# EasyEDA Pro project MicroMouse_v01.eprj, board PCB1
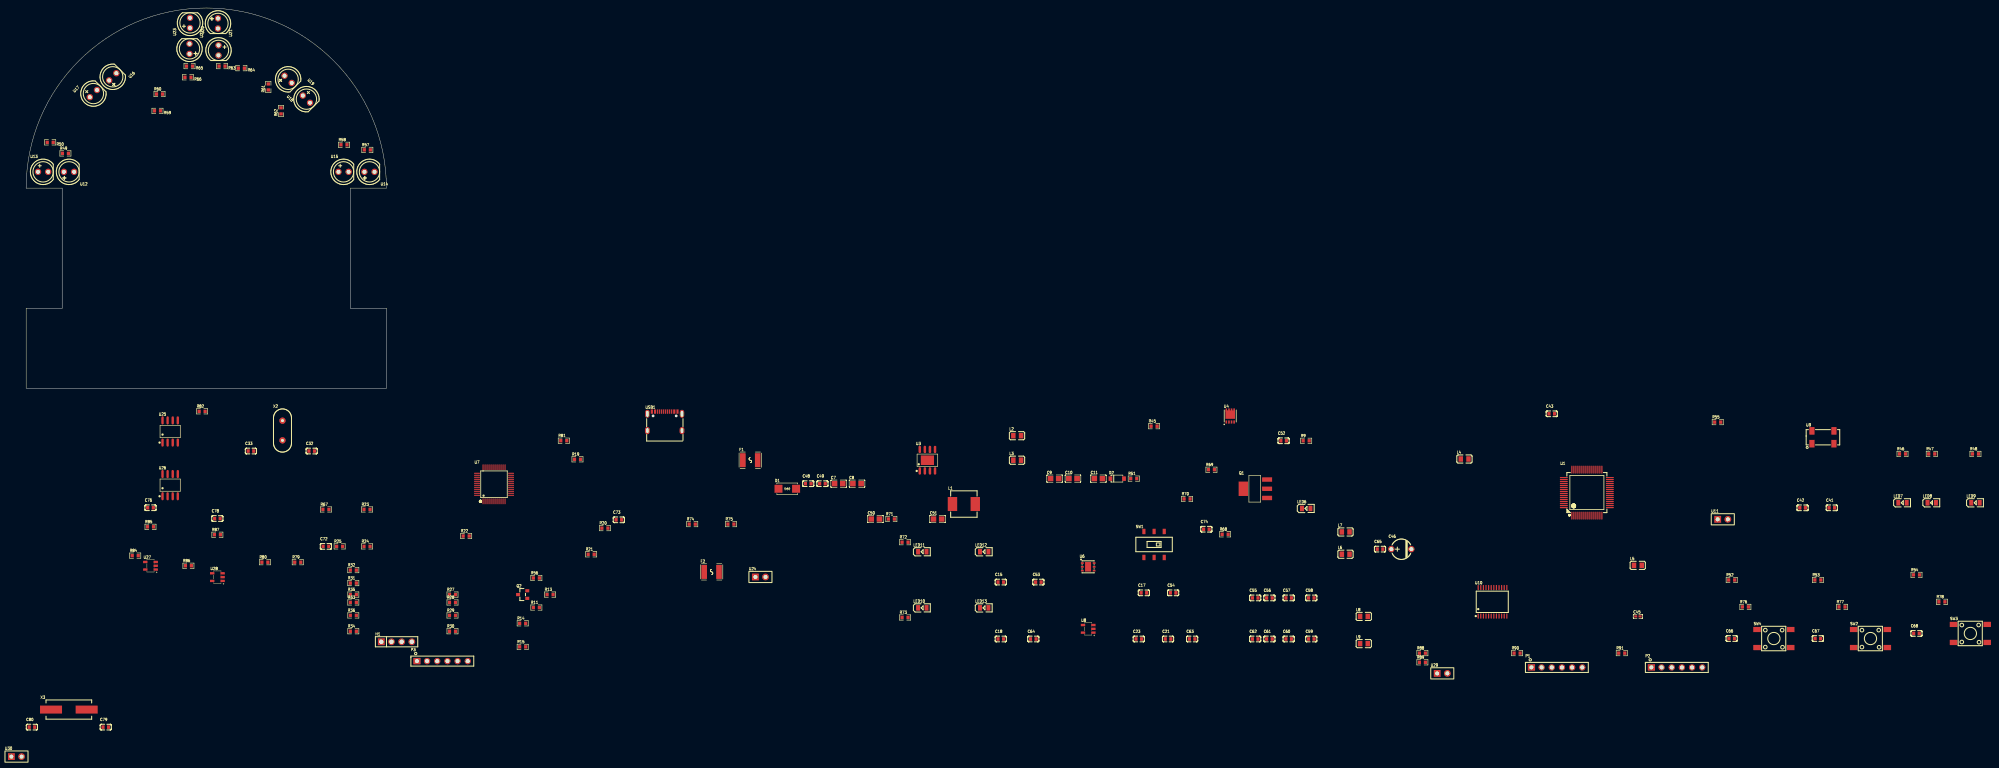
[diagram p5: board, top side]
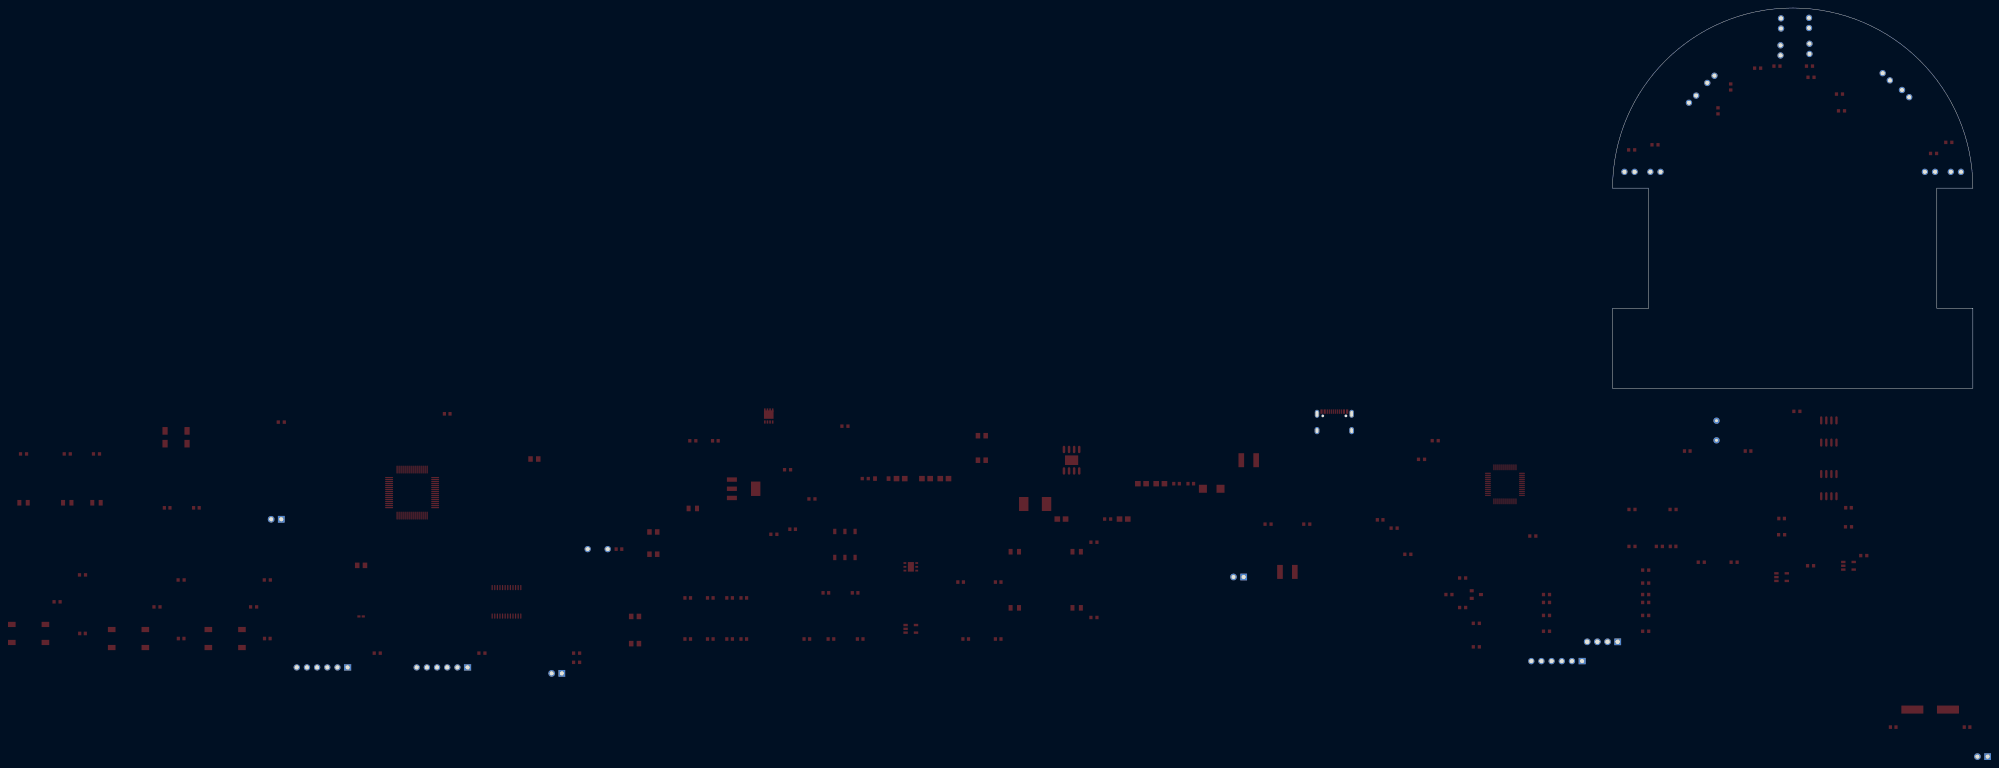
[diagram p6: board, bottom side, seen from below]

Outline 162.75 x 102.25 mm; copper layers: Top Layer, Bottom Layer. Coordinates in mm from the lower left corner of the outline.
Outline path: 0,57.25 9,57.25 9,27.25 0,27.25 0,7.25 90,7.25 90,27.25 81,27.25 81,57.25 90,57.25 arc(45,102.25) 0,57.25
Stack: Top Layer 0.035mm / Dielectric1 1.51mm FR4 er 4.5 / Bottom Layer 0.035mm

## Design rules (mm)
template: JLCPCB Capability(Two Layers Board)
spacing copperThickness1oz (default): track to track 0.102, other pairs 0.152 to 0.3
spacing copperThickness2oz: track to track 0.203, other pairs 0.152 to 0.3
track width copperThickness1oz (default): min 0.127, default 0.254, max 2.54
track width copperThickness2oz: min 0.203, default 0.254, max 2.54
differential pair differentialPair (default): width min 0.127, default 0.254, max 2.54; gap min 0.152, default 0.152
via viaSize (default): diameter min 0.5, default 0.61, max 10; hole min 0.3, default 0.305, max 6.3

## Placement (name value [footprint] x y rotation side)
C7  10uF  [C0805]  202.98 -16.6 0 top
C8  10uF  [C0805]  207.56 -16.6 0 top
C9  10uF  [C0805]  256.92 -15.33 0 top
C10  10uF  [C0805]  261.5 -15.33 0 top
C11  10uF  [C0805]  267.85 -15.33 0 top
C15  1uF  [C0603]  243.48 -41.18 0 top
C17  1uF  [C0603]  279.23 -43.87 0 top
C18  1uF  [C0603]  243.48 -55.4 0 top
C21  1uF  [C0603]  285.26 -55.4 0 top
C23  10nF  [C0603]  277.96 -55.4 0 top
C32  20pF  [C0603]  71.34 -8.44 0 top
C33  20pF  [C0603]  56.16 -8.44 0 top
C41  4.3pF  [C0603]  451.08 -22.63 0 top
C42  4.3pF  [C0603]  443.78 -22.63 0 top
C43  1uF  [C0603]  381.12 0.86 0 top
C45  100nF  [C0402]  402.63 -49.76 0 top
C46  10uF  [CAP-TH_BD5.0-P5.00-D1.0-FD]  343.53 -32.95 0 top
C48  100nF  [C0603]  195.37 -16.6 0 top
C49  100nF  [C0603]  198.92 -16.6 0 top
C50  10uF  [C0805]  212.14 -25.43 0 top
C51  10uF  [C0805]  227.68 -25.43 0 top
C52  100nF  [C0603]  314.13 -5.88 0 top
C53  100nF  [C0603]  252.86 -41.18 0 top
C54  100nF  [C0603]  286.53 -43.87 0 top
C55  100nF  [C0603]  307.03 -45.14 0 top
C56  100nF  [C0603]  310.58 -45.14 0 top
C57  100nF  [C0603]  315.4 -45.14 0 top
C58  100nF  [C0603]  321.04 -45.14 0 top
C59  100nF  [C0603]  321.04 -55.4 0 top
C60  100nF  [C0603]  315.4 -55.4 0 top
C61  100nF  [C0603]  310.58 -55.4 0 top
C62  100nF  [C0603]  307.03 -55.4 0 top
C63  100nF  [C0603]  291.28 -55.4 0 top
C64  100nF  [C0603]  251.59 -55.4 0 top
C65  100nF  [C0603]  338.22 -32.95 0 top
C66  100nF  [C0603]  426.06 -55.29 0 top
C67  100nF  [C0603]  447.59 -55.29 0 top
C68  100nF  [C0603]  472.23 -54.02 0 top
C72  100nF  [C0603]  74.89 -32.27 0 top
C73  20pF  [C0603]  148.07 -25.63 0 top
C74  10nF  [C0603]  294.83 -27.97 0 top
C76  100pF  [C0603]  31.06 -22.61 0 top
C78  100pF  [C0603]  47.77 -25.3 0 top
C79  20pF  [C0603]  19.9 -77.42 0 top
C80  20pF  [C0603]  1.45 -77.42 0 top
D1  SMAJ20CA  [SMA_L4.3-W2.6-LS5.2-BI]  190.14 -17.87 0 top
D2  MMSZ4689  [SOD-123_L2.8-W1.8-LS3.7-RD]  272.56 -15.33 0 top
F1  ASMD1812-300  [F1812]  180.89 -10.73 0 top
F2  ASMD1812-300  [F1812]  171.23 -38.64 0 top
H1  2.54-1*4P  [HDR-TH_4P-P2.54-V-F]  92.53 -56.09 0 top
L1  1uH  [IND-SMD_L7.2-W6.6_GPSR0730]  234.25 -21.68 0 top
L2  CBW201209U601T  [L0805]  247.57 -4.61 0 top
L3  CBW201209U601T  [L0805]  247.57 -10.73 0 top
L4  CBW201209U601T  [L0805]  359.34 -10.43 0 top
L5  CBW201209U601T  [L0805]  402.63 -37 0 top
L6  CBW201209U601T  [L0805]  329.63 -34.22 0 top
L7  CBW201209U601T  [L0805]  329.63 -28.65 0 top
L8  CBW201209U601T  [L0805]  334.19 -49.76 0 top
L9  CBW201209U601T  [L0805]  334.19 -56.56 0 top
LED6  XL-2012SURC  [LED0805-R-RD]  319.77 -22.78 0 top
LED7  XL-2012SURC  [LED0805-R-RD]  468.73 -21.36 0 top
LED8  XL-2012SURC  [LED0805-R-RD]  476.04 -21.36 0 top
LED9  XL-2012SURC  [LED0805-R-RD]  486.96 -21.36 0 top
LED10  XL-2012SURC  [LED0805-R-RD]  223.87 -47.62 0 top
LED11  XL-2012SURC  [LED0805-R-RD]  223.87 -33.6 0 top
LED12  XL-2012SURC  [LED0805-R-RD]  239.33 -33.6 0 top
LED13  XL-2012SURC  [LED0805-R-RD]  239.33 -47.62 0 top
P1  2.54-1*6P  [HDR-TH_6P-P2.54-V-F]  382.39 -62.5 0 top
P2  2.54-1*6P  [HDR-TH_6P-P2.54-V-F]  412.35 -62.5 0 top
P3  2.54-1*6P  [HDR-TH_6P-P2.54-V-F]  103.96 -60.93 0 top
Q1  IRLL014NTRPBF  [SOT-223-3_L6.5-W3.4-P2.30-LS7.0-BR]  307.03 -17.87 0 top
Q2  S9013  [SOT-23_L2.9-W1.3-P1.90-LS2.4-BR]  124.04 -44.3 0 top
R9  10K  [R0603]  319.77 -5.88 0 top
R11  36kΩ  [R0603]  127.46 -47.54 0 top
R13  100Ω  [R0603]  130.88 -44.3 0 top
R14  1.5kΩ  [R0603]  124.04 -51.49 0 top
R15  0Ω  [R0603]  124.04 -57.36 0 top
R19  0Ω  [R0603]  137.73 -10.51 0 top
R20  100Ω  [R0603]  144.57 -27.7 0 top
R21  100Ω  [R0603]  141.15 -34.24 0 top
R22  0Ω  [R0603]  109.93 -29.68 0 top
R23  4.7kΩ  [R0603]  85.16 -23.04 0 top
R24  4.7kΩ  [R0603]  85.16 -32.27 0 top
R25  0Ω  [R0603]  78.31 -32.27 0 top
R27  0Ω  [R0603]  106.5 -44.3 0 top
R28  0Ω  [R0603]  106.5 -46.27 0 top
R29  0Ω  [R0603]  106.5 -49.51 0 top
R30  0Ω  [R0603]  106.5 -53.46 0 top
R31  0Ω  [R0603]  81.73 -41.43 0 top
R32  0Ω  [R0603]  81.73 -38.19 0 top
R33  0Ω  [R0603]  81.73 -46.27 0 top
R34  0Ω  [R0603]  81.73 -53.46 0 top
R35  0Ω  [R0603]  81.73 -44.3 0 top
R36  0Ω  [R0603]  81.73 -49.51 0 top
R45  10K  [R0603]  281.77 -2.23 0 top
R46  10K  [R0603]  468.73 -9.16 0 top
R47  10K  [R0603]  476.04 -9.16 0 top
R48  10K  [R0603]  486.96 -9.16 0 top
R49  150Ω  [R0603]  9.81 65.92 0 top
R50  10K  [R0603]  6.01 68.68 180 top
R51  10K  [R0603]  276.69 -15.33 0 top
R52  10K  [R0603]  426.06 -40.65 0 top
R53  10K  [R0603]  447.59 -40.65 0 top
R54  10K  [R0603]  472.23 -39.38 0 top
R55  10K  [R0603]  422.57 -1.21 0 top
R56  10K  [R0603]  127.46 -40.16 0 top
R57  150Ω  [R0603]  85.23 66.8 0 top
R58  10K  [R0603]  79.4 68.07 0 top
R59  150Ω  [R0603]  32.81 76.56 180 top
R60  10K  [R0603]  33.32 80.75 0 top
R61  150Ω  [R0603]  60.49 82.53 90 top
R62  10K  [R0603]  63.67 76.56 90 top
R63  150Ω  [R0603]  48.94 87.73 180 top
R64  10K  [R0603]  53.76 87.22 180 top
R65  150Ω  [R0603]  40.81 87.73 180 top
R66  10K  [R0603]  40.43 84.94 180 top
R67  100kΩ  [R0603]  74.89 -23.04 0 top
R68  100kΩ  [R0603]  299.52 -29.24 0 top
R69  100kΩ  [R0603]  296.1 -13.11 0 top
R70  1kΩ  [R0603]  290.01 -20.41 0 top
R71  56kΩ  [R0603]  216.14 -25.43 0 top
R72  1kΩ  [R0603]  219.56 -31.22 0 top
R73  1kΩ  [R0603]  219.56 -50.03 0 top
R74  5.1kΩ  [R0603]  166.4 -26.7 0 top
R75  5.1kΩ  [R0603]  176.06 -26.7 0 top
R76  1kΩ  [R0603]  429.48 -47.38 0 top
R77  1kΩ  [R0603]  453.62 -47.38 0 top
R78  1kΩ  [R0603]  478.58 -46.11 0 top
R79  10K  [R0603]  67.84 -36.21 0 top
R80  10K  [R0603]  59.64 -36.21 0 top
R81  100kΩ  [R0603]  134.3 -5.85 0 top
R82  4.7kΩ  [R0603]  43.96 1.48 0 top
R84  10K  [R0603]  27.25 -34.56 0 top
R85  22kΩ  [R0603]  31.06 -27.37 0 top
R86  10K  [R0603]  40.54 -37.1 0 top
R87  22kΩ  [R0603]  47.77 -29.35 0 top
R88  0Ω  [R0603]  348.79 -58.94 0 top
R89  0Ω  [R0603]  348.79 -61.23 0 top
R90  0Ω  [R0603]  372.45 -58.94 0 top
R91  0Ω  [R0603]  398.6 -58.94 0 top
SW1  SS-3235S-L3  [SW-SMD_SS-3235S-L3.00]  281.77 -31.78 0 top
SW2  TS-1002S-04326C  [KEY-SMD_4P-L6.0-W6.0-P4.50-LS9.0]  460.73 -55.29 0 top
SW3  TS-1002S-04326C  [KEY-SMD_4P-L6.0-W6.0-P4.50-LS9.0]  485.69 -54.02 0 top
SW4  TS-1002S-04326C  [KEY-SMD_4P-L6.0-W6.0-P4.50-LS9.0]  436.59 -55.29 0 top
U1  STM32F446RET6  [LQFP-64_L10.0-W10.0-P0.50-LS12.0-BL]  389.89 -18.82 0 top
U3  ETA9740E8A  [ESOP-8_L4.9-W3.9-P1.27-LS6.0-BL-EP-1]  225.14 -10.73 0 top
U4  AON7403  [DFN-8_L3.0-W3.0-P0.65-BL]  300.79 0.31 0 top
U6  LD39050PU33R  [DFN-6_L3.0-W3.0-P0.95-LS3.1-TL-EP]  265.31 -37.37 0 top
U7  STM32F103CBT6  [LQFP-48_L7.0-W7.0-P0.50-LS9.0-BL]  116.89 -16.75 0 top
U8  LD3985M33R  [SOT-23-5_L3.0-W1.7-P0.95-LS2.8-BR]  265.31 -52.86 0 top
U9  32.768kHz  [SOJ-4_L8.4-W3.8-P5.5-BL]  448.86 -5 0 top
U10  TB6612FNG,C,8,EL  [SSOP-24_L8.3-W5.6-P0.65-LS7.6-BL]  366.31 -46.11 0 top
U11  ZX-PM2.54-1-2PY  [HDR-TH_2P-P2.54-V-F]  423.84 -25.49 0 top
U12  HIR7373C  [LED-TH_BD5.0-P2.54-L-RD]  10.71 61.32 180 top
U13  DY-PD333-3B-L3  [LED-TH_BD5.0-P2.54-FD]  4.23 61.32 0 top
U14  HIR7373C  [LED-TH_BD5.0-P2.54-L-RD]  85.77 61.32 180 top
U15  DY-PD333-3B-L3  [LED-TH_BD5.0-P2.54-FD]  79.29 61.32 0 top
U16  HIR7373C  [LED-TH_BD5.0-P2.54-L-RD]  21.63 85.07 225 top
U17  DY-PD333-3B-L3  [LED-TH_BD5.0-P2.54-FD]  16.81 80.87 45 top
U18  HIR7373C  [LED-TH_BD5.0-P2.54-L-RD]  65.45 84.43 135 top
U19  DY-PD333-3B-L3  [LED-TH_BD5.0-P2.54-FD]  70.02 79.48 315 top
U20  HIR7373C  [LED-TH_BD5.0-P2.54-L-RD]  47.92 98.4 90 top
U21  DY-PD333-3B-L3  [LED-TH_BD5.0-P2.54-FD]  48.05 91.67 270 top
U22  HIR7373C  [LED-TH_BD5.0-P2.54-L-RD]  40.81 92.05 270 top
U23  DY-PD333-3B-L3  [LED-TH_BD5.0-P2.54-FD]  40.94 98.53 90 top
U24  ZX-PM2.54-1-2PY  [HDR-TH_2P-P2.54-V-F]  183.43 -39.91 0 top
U25  ACS722LLCTR-05AB-T  [SOIC-8_L4.9-W3.9-P1.27-LS6.0-BL]  35.98 -3.55 0 top
U26  ACS722LLCTR-05AB-T  [SOIC-8_L4.9-W3.9-P1.27-LS6.0-BL]  35.98 -16.96 0 top
U27  OPA344NA/250  [SOT-23-5_L3.0-W1.7-P0.95-LS2.8-BR]  31.06 -37.1 0 top
U28  OPA344NA/250  [SOT-23-5_L3.0-W1.7-P0.95-LS2.8-BR]  47.77 -39.94 0 top
U29  ZX-PM2.54-1-2PY  [HDR-TH_2P-P2.54-V-F]  353.76 -63.99 0 top
U30  ZX-PM2.54-1-2PY  [HDR-TH_2P-P2.54-V-F]  -2.41 -84.78 0 top
USB1  TYPE-C 16PIN 2MD(073)  [USB-C-SMD_TYPE-C-6PIN-2MD-073]  159.51 -0.96 0 top
X2  8MHz  [OSC-TH_L10.0-W4.5-P5.00]  64.03 -3.31 0 top
X3  8MHz  [CRYSTAL-SMD_L11.5-W4.8-LS12.7]  10.66 -73.04 0 top

## Footprints (pads in the part's own frame, mm; a bottom-side part is the same pattern mirrored in y, then rotated)
C0402
  rect 0.79x0.54 smd: 1(-0.545,0) 2(0.545,0)
C0603
  rect 0.8x0.9 smd: 1(-0.7,0) 2(0.7,0)
C0805
  rect 1.41x1.35 smd: 1(-1.03,0) 2(1.03,0)
CAP-TH_BD5.0-P5.00-D1.0-FD
  round 1.6 hole 1: 1(-2.5,0) 2(2.5,0)
CRYSTAL-SMD_L11.5-W4.8-LS12.7
  rect 5.5x2 smd: 1(-4.45,0) 2(4.45,0)
DFN-6_L3.0-W3.0-P0.95-LS3.1-TL-EP
  rect 0.701x0.45 smd: 1(-1.476,0.95) 2(-1.476,0) 3(-1.476,-0.95) 4(1.476,-0.95) 5(1.476,0) 6(1.476,0.95)
  rect 1.5x2.4 smd: 7(-0.025,0)
DFN-8_L3.0-W3.0-P0.65-BL
  rect 0.4x0.8 smd: 1(-0.975,-1.5) 2(-0.325,-1.5) 3(0.325,-1.5) 4(0.975,-1.5) 5(0.975,1.5) 6(0.325,1.5) 7(-0.325,1.5) 8(-0.975,1.5)
  rect 2.4x2.1 smd: 9(0,0.35)
ESOP-8_L4.9-W3.9-P1.27-LS6.0-BL-EP-1
  oval 0.63x1.865 smd: 1(-1.905,-2.683) 2(-0.635,-2.683) 3(0.635,-2.683) 4(1.905,-2.683) 5(1.905,2.683) 6(0.635,2.683) 7(-0.635,2.683) 8(-1.905,2.683)
  rect 3.3x2.4 smd: 9(0,0)
F1812
  rect 1.407x3.499 smd: 1(-1.853,0) 2(1.853,0)
HDR-TH_2P-P2.54-V-F
  rect 1.7x1.7 hole 1: 1(-1.27,0)
  round 1.7 hole 1: 2(1.27,0)
HDR-TH_4P-P2.54-V-F
  rect 1.7x1.7 hole 1.1: 1(-3.81,0)
  round 1.7 hole 1.1: 2(-1.27,0) 3(1.27,0) 4(3.81,0)
HDR-TH_6P-P2.54-V-F
  rect 1.8x1.6 hole 1.02: 1(-6.35,0)
  round 1.6 hole 1.02: 2(-3.81,0) 3(-1.27,0) 4(1.27,0) 5(3.81,0) 6(6.35,0)
IND-SMD_L7.2-W6.6_GPSR0730
  rect 2.35x3.5 smd: 1(-2.85,0) 2(2.85,0)
KEY-SMD_4P-L6.0-W6.0-P4.50-LS9.0
  rect 1.9x1.3 smd: 1(-4.2,2.25) 2(4.2,2.25) 3(-4.2,-2.25) 4(4.2,-2.25)
L0805
  rect 1.133x1.377 smd: 1(-0.966,0) 2(0.966,0)
LED0805-R-RD
  rect 1x1.399 smd: 1(1.05,0) 2(-1.05,0)
LED-TH_BD5.0-P2.54-FD
  round 1.6 hole 1: 1(-1.27,0) 2(1.27,0)
LED-TH_BD5.0-P2.54-L-RD
  round 1.6 hole 1: 1(-1.27,0) 2(1.27,0)
LQFP-48_L7.0-W7.0-P0.50-LS9.0-BL
  oval 0.27x1.5 smd: 1(-2.75,-4.25) 2(-2.25,-4.25) 3(-1.75,-4.25) 4(-1.25,-4.25) 5(-0.75,-4.25) 6(-0.25,-4.25) 7(0.25,-4.25) 8(0.75,-4.25) 9(1.25,-4.25) 10(1.75,-4.25) 11(2.25,-4.25) 12(2.75,-4.25) 25(2.75,4.25) 26(2.25,4.25) 27(1.75,4.25) 28(1.25,4.25) 29(0.75,4.25) 30(0.25,4.25) 31(-0.25,4.25) 32(-0.75,4.25) 33(-1.25,4.25) 34(-1.75,4.25) 35(-2.25,4.25) 36(-2.75,4.25)
  oval 1.5x0.27 smd: 13(4.25,-2.75) 14(4.25,-2.25) 15(4.25,-1.75) 16(4.25,-1.25) 17(4.25,-0.75) 18(4.25,-0.25) 19(4.25,0.25) 20(4.25,0.75) 21(4.25,1.25) 22(4.25,1.75) 23(4.25,2.25) 24(4.25,2.75) 37(-4.25,2.75) 38(-4.25,2.25) 39(-4.25,1.75) 40(-4.25,1.25) 41(-4.25,0.75) 42(-4.25,0.25) 43(-4.25,-0.25) 44(-4.25,-0.75) 45(-4.25,-1.25) 46(-4.25,-1.75) 47(-4.25,-2.25) 48(-4.25,-2.75)
LQFP-64_L10.0-W10.0-P0.50-LS12.0-BL
  oval 0.3x2 smd: 1(-3.75,-5.75) 2(-3.25,-5.75) 3(-2.75,-5.75) 4(-2.25,-5.75) 5(-1.75,-5.75) 6(-1.25,-5.75) 7(-0.75,-5.75) 8(-0.25,-5.75) 9(0.25,-5.75) 10(0.75,-5.75) 11(1.25,-5.75) 12(1.75,-5.75) 13(2.25,-5.75) 14(2.75,-5.75) 15(3.25,-5.75) 16(3.75,-5.75) 33(3.75,5.75) 34(3.25,5.75) 35(2.75,5.75) 36(2.25,5.75) 37(1.75,5.75) 38(1.25,5.75) 39(0.75,5.75) 40(0.25,5.75) 41(-0.25,5.75) 42(-0.75,5.75) 43(-1.25,5.75) 44(-1.75,5.75) 45(-2.25,5.75) 46(-2.75,5.75) 47(-3.25,5.75) 48(-3.75,5.75)
  oval 2x0.3 smd: 17(5.75,-3.75) 18(5.75,-3.25) 19(5.75,-2.75) 20(5.75,-2.25) 21(5.75,-1.75) 22(5.75,-1.25) 23(5.75,-0.75) 24(5.75,-0.25) 25(5.75,0.25) 26(5.75,0.75) 27(5.75,1.25) 28(5.75,1.75) 29(5.75,2.25) 30(5.75,2.75) 31(5.75,3.25) 32(5.75,3.75) 49(-5.75,3.75) 50(-5.75,3.25) 51(-5.75,2.75) 52(-5.75,2.25) 53(-5.75,1.75) 54(-5.75,1.25) 55(-5.75,0.75) 56(-5.75,0.25) 57(-5.75,-0.25) 58(-5.75,-0.75) 59(-5.75,-1.25) 60(-5.75,-1.75) 61(-5.75,-2.25) 62(-5.75,-2.75) 63(-5.75,-3.25) 64(-5.75,-3.75)
OSC-TH_L10.0-W4.5-P5.00
  round 1.6 hole 0.7: 1(0,2.45) 2(0,-2.45)
R0603
  rect 0.806x0.864 smd: 1(-0.753,0) 2(0.753,0)
SMA_L4.3-W2.6-LS5.2-BI
  rect 2x2 smd: 1(-2.2,0) 2(2.2,0)
SOD-123_L2.8-W1.8-LS3.7-RD
  rect 0.95x1.15 smd: 1(-1.692,0) 2(1.692,0)
SOIC-8_L4.9-W3.9-P1.27-LS6.0-BL
  oval 0.588x2.045 smd: 1(-1.905,-2.772) 2(-0.635,-2.772) 3(0.635,-2.772) 4(1.905,-2.772) 5(1.905,2.772) 6(0.635,2.772) 7(-0.635,2.772) 8(-1.905,2.772)
SOJ-4_L8.4-W3.8-P5.5-BL
  rect 1.3x1.9 smd: 1(-2.75,-1.6) 2(2.75,-1.6) 3(2.75,1.6) 4(-2.75,1.6)
SOT-23-5_L3.0-W1.7-P0.95-LS2.8-BR
  rect 1.1x0.6 smd: 1(1.3,-0.95) 2(1.3,0) 3(1.3,0.95) 4(-1.3,0.95) 5(-1.3,-0.95)
SOT-23_L2.9-W1.3-P1.90-LS2.4-BR
  rect 1x0.8 smd: 1(1.15,-0.95) 2(1.15,0.95) 3(-1.15,0)
SOT-223-3_L6.5-W3.4-P2.30-LS7.0-BR
  rect 2.5x1.1 smd: 1(2.97,-2.3) 2(2.97,0) 3(2.97,2.3)
  rect 2.34x3.6 smd: 4(-2.97,0)
SSOP-24_L8.3-W5.6-P0.65-LS7.6-BL
  oval 0.308x1.324 smd: 1(-3.575,-3.562) 2(-2.925,-3.562) 3(-2.275,-3.562) 4(-1.625,-3.562) 5(-0.975,-3.562) 6(-0.325,-3.562) 7(0.325,-3.562) 8(0.975,-3.562) 9(1.625,-3.562) 10(2.275,-3.562) 11(2.925,-3.562) 12(3.575,-3.562) 13(3.575,3.562) 14(2.925,3.562) 15(2.275,3.562) 16(1.625,3.562) 17(0.975,3.562) 18(0.325,3.562) 19(-0.325,3.562) 20(-0.975,3.562) 21(-1.625,3.562) 22(-2.275,3.562) 23(-2.925,3.562) 24(-3.575,3.562)
SW-SMD_SS-3235S-L3.00
  rect 0.8x1.35 smd: 1(-2.54,3.25) 2(0,3.25) 3(2.54,3.25) 4(-2.54,-3.25) 5(0,-3.25) 6(2.54,-3.25)
USB-C-SMD_TYPE-C-6PIN-2MD-073
  rect 0.55x1.1 smd: 1(-3.2,2.375) 2(-2.4,2.375) 11(2.4,2.375) 12(3.2,2.375)
  rect 0.3x1.1 smd: 3(-1.75,2.375) 4(-1.25,2.375) 5(-0.75,2.375) 6(-0.25,2.375) 7(0.25,2.375) 8(0.75,2.375) 9(1.25,2.375) 10(1.75,2.375)
  oval 1.1x2 hole 0.6x1.5: 13(-4.325,1.825) 14(4.325,1.825)
  oval 1.2x1.8 hole 0.6x1.2: 13(-4.325,-2.375) 14(4.325,-2.375)

## Nets
As in the schematic.

Pads without a net: SW1 3 4 5 6; SW2 1 4; SW3 1 4; SW4 1 4; U1 21 29 33 34 35 36 53 58; U6 3 5; U7 4 10 11 14 16 17 22 30 40 41 42 43 45 46; USB1 3 9
